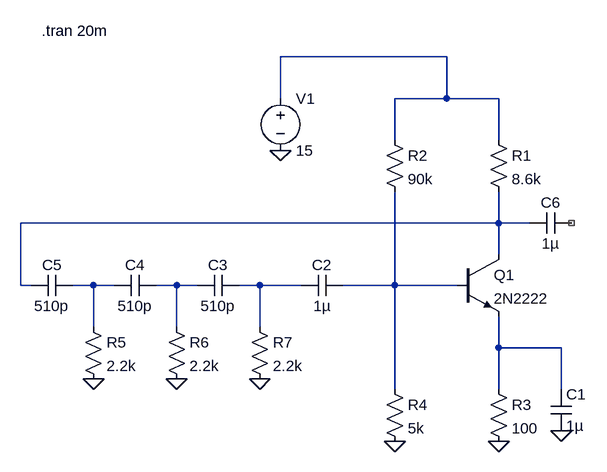
[diagram p0: schematic projectbetter.asc]
projectbetter.asc, the LTspice schematic file:
Version 4
SHEET 1 880 680
WIRE 144 -160 -112 -160
WIRE -112 -96 -112 -160
WIRE 144 -96 144 -160
WIRE 144 -96 64 -96
WIRE 224 -96 144 -96
WIRE 64 -32 64 -96
WIRE 224 -32 224 -96
WIRE 224 96 224 48
WIRE 224 96 -512 96
WIRE 272 96 224 96
WIRE 224 144 224 96
WIRE -512 192 -512 96
WIRE -496 192 -512 192
WIRE -400 192 -432 192
WIRE -368 192 -400 192
WIRE -272 192 -304 192
WIRE -240 192 -272 192
WIRE -144 192 -176 192
WIRE -80 192 -144 192
WIRE 64 192 64 48
WIRE 64 192 -16 192
WIRE 160 192 64 192
WIRE -400 256 -400 192
WIRE -272 256 -272 192
WIRE -144 256 -144 192
WIRE 224 288 224 240
WIRE 320 288 224 288
WIRE 64 352 64 192
WIRE 224 352 224 288
WIRE 320 352 320 288
FLAG -400 336 0
FLAG -272 336 0
FLAG -144 336 0
FLAG 64 432 0
FLAG 224 432 0
FLAG 320 416 0
FLAG -112 -16 0
DATAFLAG 224 96 ""
DATAFLAG 224 288 ""
DATAFLAG 64 192 ""
SYMBOL npn 160 144 R0
SYMATTR InstName Q1
SYMATTR Value 2N2222
SYMBOL res 208 -48 R0
SYMATTR InstName R1
SYMATTR Value 8.6k
SYMBOL res 48 -48 R0
SYMATTR InstName R2
SYMATTR Value 90k
SYMBOL res 48 336 R0
SYMATTR InstName R4
SYMATTR Value 5k
SYMBOL cap 304 352 R0
SYMATTR InstName C1
SYMATTR Value 1µ
SYMBOL cap -16 176 R90
WINDOW 0 0 32 VBottom 2
WINDOW 3 32 32 VTop 2
SYMATTR InstName C2
SYMATTR Value 1µ
SYMBOL cap -176 176 R90
WINDOW 0 0 32 VBottom 2
WINDOW 3 32 32 VTop 2
SYMATTR InstName C3
SYMATTR Value 510p
SYMBOL cap -304 176 R90
WINDOW 0 0 32 VBottom 2
WINDOW 3 32 32 VTop 2
SYMATTR InstName C4
SYMATTR Value 510p
SYMBOL cap -432 176 R90
WINDOW 0 0 32 VBottom 2
WINDOW 3 32 32 VTop 2
SYMATTR InstName C5
SYMATTR Value 510p
SYMBOL res -416 240 R0
SYMATTR InstName R5
SYMATTR Value 2.2k
SYMBOL res -288 240 R0
SYMATTR InstName R6
SYMATTR Value 2.2k
SYMBOL res -160 240 R0
SYMATTR InstName R7
SYMATTR Value 2.2k
SYMBOL voltage -112 -112 R0
WINDOW 123 0 0 Left 0
WINDOW 39 0 0 Left 0
SYMATTR InstName V1
SYMATTR Value 15
SYMBOL cap 336 80 R90
WINDOW 0 0 32 VBottom 2
WINDOW 3 32 32 VTop 2
SYMATTR InstName C6
SYMATTR Value 1µ
SYMBOL res 208 336 R0
SYMATTR InstName R3
SYMATTR Value 100
TEXT -480 -200 Left 2 !.tran 20m

The netlist it stands for:
* projectbetter.asc
Q1 N002 N006 N007 0 2N2222
R1 N001 N002 8.6k
R2 N001 N006 90k
R4 N006 0 5k
C1 N007 0 1µ
C2 N006 N005 1µ
C3 N005 N004 510p
C4 N004 N003 510p
C5 N003 N002 510p
R5 N003 0 2.2k
R6 N004 0 2.2k
R7 N005 0 2.2k
V1 N001 0 15
C6 NC_01 N002 1µ
R3 N007 0 100
.model NPN NPN
.model PNP PNP
.lib standard.bjt
.tran 20m
.backanno
.end